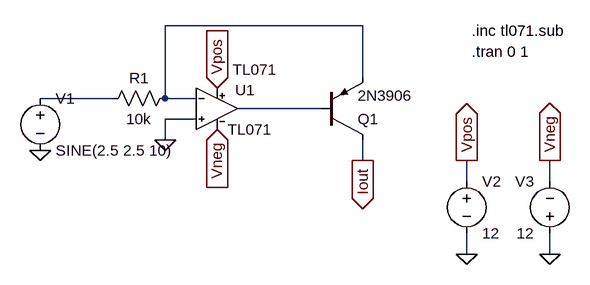
[diagram p0: schematic v2i.asc]
v2i.asc, the LTspice schematic file:
Version 4
SHEET 1 1184 680
WIRE 512 160 208 160
WIRE 512 240 512 160
WIRE 128 272 16 272
WIRE 208 272 208 160
WIRE 256 272 208 272
WIRE 448 288 320 288
WIRE 256 304 208 304
WIRE 208 336 208 304
WIRE 512 368 512 336
WIRE 672 400 672 368
WIRE 800 400 800 368
WIRE 672 512 672 480
WIRE 800 512 800 480
FLAG 672 512 0
FLAG 800 512 0
FLAG 672 368 Vpos
IOPIN 672 368 Out
FLAG 800 368 Vneg
IOPIN 800 368 Out
FLAG 288 256 Vpos
IOPIN 288 256 In
FLAG 208 336 0
FLAG 16 352 0
FLAG 288 320 Vneg
IOPIN 288 320 In
FLAG 512 368 Iout
IOPIN 512 368 Out
SYMBOL pnp 448 336 M180
SYMATTR InstName Q1
SYMATTR Value 2N3906
SYMBOL voltage 672 384 R0
SYMATTR InstName V2
SYMATTR Value 12
SYMBOL voltage 800 496 R180
WINDOW 0 24 96 Left 2
WINDOW 3 24 16 Left 2
SYMATTR InstName V3
SYMATTR Value 12
SYMBOL Voltage 16 256 R0
SYMATTR InstName V1
SYMATTR Value SINE(2.5 2.5 10)
SYMBOL res 224 256 R90
WINDOW 0 0 56 VBottom 2
WINDOW 3 32 56 VTop 2
SYMATTR InstName R1
SYMATTR Value 10k
SYMBOL TL071 288 224 R0
WINDOW 0 28 35 Left 2
WINDOW 38 24 4 Left 2
SYMATTR InstName U1
TEXT 680 200 Left 2 !.tran 0 1
TEXT 680 168 Left 2 !.inc tl071.sub

The netlist it stands for:
* v2i.asc
Q1 Iout N003 N001 0 2N3906
V2 Vpos 0 12
V3 0 Vneg 12
V1 N002 0 SINE(2.5 2.5 10)
R1 N001 N002 10k
XU1 0 N001 Vpos Vneg N003 TL071 TL071  ; pins In+ In- V+ V- OUT
.model NPN NPN
.model PNP PNP
.lib standard.bjt
.tran 0 1
.inc tl071.sub
.lib TL071.sub
.backanno
.end